# Altium schematic sheet UI.SchDoc
size 420 x 297 mm; SheetNumber: 5; SheetTotal: 6
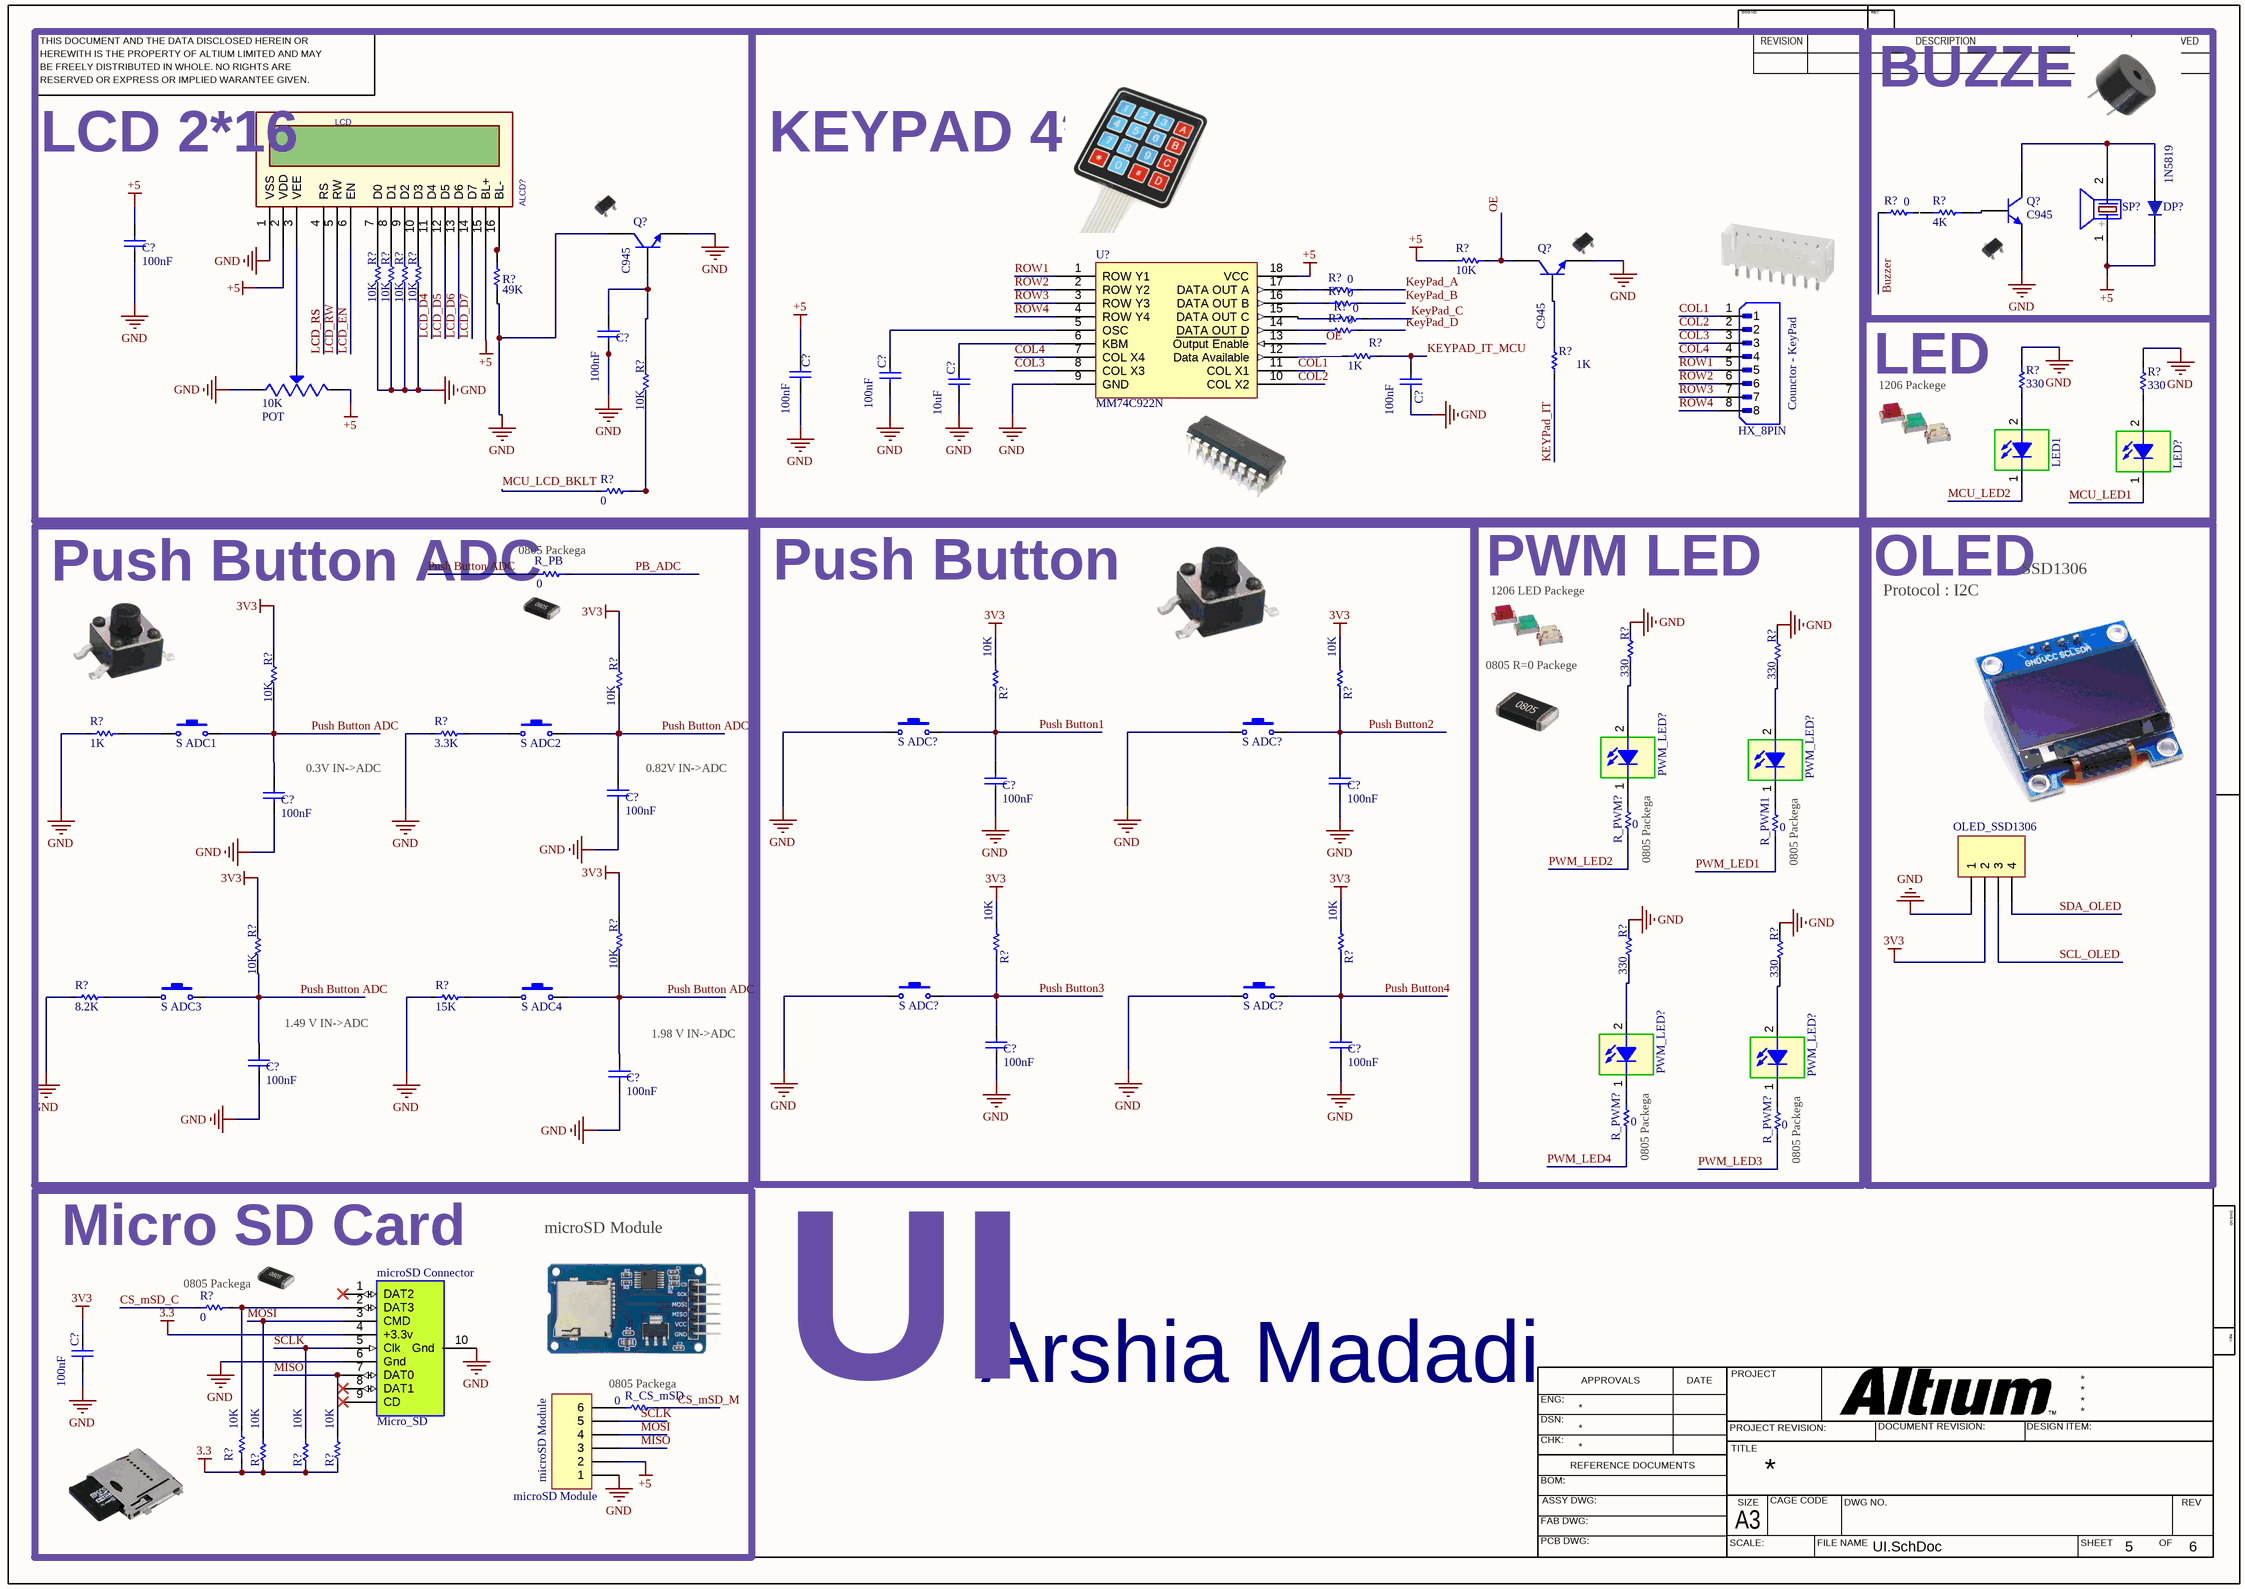
[diagram p0: UI.SchDoc]

## Parts
(Parts that share a designator on the sheet are numbered #1, #2 ... from top to bottom, then left to right.)
10K  POT  [TRIM_3296W1103LF]
ALCD?  LCD  [LCD_2X16 BLUE - 2.5mm]
C?#1  100nF  [MY_CAP_SMD_0603]
C?#2  100nF  [MY_CAP_SMD_0603]
C?#3  100nF  [CAPC3413X12N]
C?#4  100nF  [CAPC4817X12N]
C?#5  10uF  [CAPC4817X12N]
C?#6  100nF  [CAPC4817X12N]
C?#7  100nF  [MY_CAP_SMD_0603]
C?#8  100nF  [MY_CAP_SMD_0603]
C?#9  100nF  [MY_CAP_SMD_0603]
C?#10  100nF  [MY_CAP_SMD_0603]
C?#11  100nF  [MY_CAP_SMD_0603]
C?#12  100nF  [MY_CAP_SMD_0603]
C?#13  100nF  [MY_CAP_SMD_0603]
C?#14  100nF  [MY_CAP_SMD_0603]
C?#15  100nF  [CAPC4817X12N]
Counctor_-_KeyPad  HX_8PIN  [JST_B8B-XH-A(LF)(SN)]
DP?  1N5819  [430X270D]
LED1  SMD 1206 LED  [LED 1206]  (value not drawn)
LED?  SMD 1206 LED  [LED 1206]  (value not drawn)
microSD_Connector  Micro_SD  [MicroSd Connector]
microSD_Module  microSD Module  [HDR1X6-1]
OLED_SSD1306  Header 4  [My_1X04]  (value not drawn)
PWM_LED?#1  SMD 1206 LED  [LED 1206]  (value not drawn)
PWM_LED?#2  SMD 1206 LED  [LED 1206]  (value not drawn)
PWM_LED?#3  SMD 1206 LED  [LED 1206]  (value not drawn)
PWM_LED?#4  SMD 1206 LED  [LED 1206]  (value not drawn)
Q?#1  C945  [SOT23_M]
Q?#2  C945  [SOT23_M]
Q?#3  C945  [SOT23_M]
R?#1  4K  [RESC3413X04N]
R?#2  0  [0805]
R?#3  10K  [RESC3413X04N]
R?#4  10K  [RESC3413X04N]
R?#5  10K  [RESC3413X04N]
R?#6  10K  [RESC3413X04N]
R?#7  49K  [RESC3413X04N]
R?#8  10K  [1206_Res]
R?#9  0  [0805]
R?#10  0  [0805]
R?#11  0  [0805]
R?#12  1K  [1206_Res]
R?#13  0  [0805]
R?#14  330  [0805]
R?#15  330  [0805]
R?#16  1K  [1206_Res]
R?#17  10K  [RESC3413X04N]
R?#18  0  [0805]
R?#19  330  [RESC3413X04N]
R?#20  330  [RESC3413X04N]
R?#21  10K  [RESC3413X04N]
R?#22  10K  [RESC3413X04N]
R?#23  10K  [1206_Res]
R?#24  10K  [1206_Res]
R?#25  1K  [1206_Res]
R?#26  3.3K  [1206_Res]
R?#27  10K  [RESC3413X04N]
R?#28  10K  [RESC3413X04N]
R?#29  330  [RESC3413X04N]
R?#30  330  [RESC3413X04N]
R?#31  10K  [1206_Res]
R?#32  10K  [1206_Res]
R?#33  8.2K  [1206_Res]
R?#34  15K  [1206_Res]
R?#35  0  [0805]
R?#36  10K  [1206_Res]
R?#37  10K  [1206_Res]
R?#38  10K  [1206_Res]
R?#39  10K  [1206_Res]
R_CS_mSD  0  [0805]
R_PB  0  [0805]
R_PWM1  0  [0805]
R_PWM?#1  0  [0805]
R_PWM?#2  0  [0805]
R_PWM?#3  0  [0805]
S_ADC1  Switch PB  [SW-PB]  (value not drawn)
S_ADC2  Switch PB  [SW-PB]  (value not drawn)
S_ADC3  Switch PB  [SW-PB]  (value not drawn)
S_ADC4  Switch PB  [SW-PB]  (value not drawn)
S_ADC?#1  Switch PB  [SW-PB]  (value not drawn)
S_ADC?#2  Switch PB  [SW-PB]  (value not drawn)
S_ADC?#3  Switch PB  [SW-PB]  (value not drawn)
S_ADC?#4  Switch PB  [SW-PB]  (value not drawn)
SP?  (no value)  [BUZZER 7.62mm DC]
U?  MM74C922N  [DIP18]

## Blocks framed on the sheet
LCD 2*16: 10K ALCD? C?#1 C?#2 Q?#2 R?#3-R?#7 R?#17 R?#18
KEYPAD 4*4: C?#3-C?#6 Counctor_-_KeyPad Q?#3 R?#8-R?#13 R?#16 U?
BUZZER: DP? Q?#1 R?#1 R?#2 SP?
LED: LED1 LED? R?#14 R?#15
Push Button ADC: C?#9 C?#10 C?#13 C?#14 R?#21 R?#22 R?#25-R?#28 R?#33 R?#34 R_PB S_ADC1-S_ADC4
Push Button: C?#7 C?#8 C?#11 C?#12 R?#23 R?#24 R?#31 R?#32 S_ADC?#1-S_ADC?#4
PWM LED: PWM_LED?#1-PWM_LED?#4 R?#19 R?#20 R?#29 R?#30 R_PWM1 R_PWM?#1-R_PWM?#3
OLED: OLED_SSD1306
Micro SD Card: C?#15 microSD_Connector microSD_Module R?#35-R?#39 R_CS_mSD

## Nets
3.3: microSD_Connector.4(+3.3v) R?#36.2 R?#37.2 R?#38.2 R?#39.2
3V3: C?#15.2 OLED_SSD1306.2 R?#21.1 R?#22.1 R?#23.2 R?#24.2 R?#27.1 R?#28.1 R?#31.2 R?#32.2
+5: 10K.3(CW) ALCD?.2(VDD) ALCD?.15(BL+) C?#1.1 C?#3.2 DP?.2 microSD_Module.2 R?#8.2 SP?.1(+) U?.18(VCC)
GND: 10K.1(CCW) ALCD?.1(VSS) C?#1.2 C?#2.2 C?#3.1 C?#4.1 C?#5.1 C?#6.1 C?#7.2 C?#8.2 C?#9.2 C?#10.2 C?#11.2 C?#12.2 C?#13.2 C?#14.2 C?#15.1 microSD_Connector.6(Gnd) microSD_Connector.10(Gnd) microSD_Module.1 OLED_SSD1306.1 Q?#1.2(E) Q?#2.2(E) Q?#2.3(C) Q?#3.2(E) R?#3.2 R?#4.2 R?#5.2 R?#6.2 R?#7.2 R?#14.1 R?#15.1 R?#19.1 R?#20.1 R?#25.1 R?#26.1 R?#29.1 R?#30.1 R?#33.1 R?#34.1 S_ADC?#1.1 S_ADC?#2.1 S_ADC?#3.1 S_ADC?#4.1 U?.9(GND)
Buzzer: R?#2.2
COL1: Counctor_-_KeyPad.1 U?.11(COL_X1)
COL2: Counctor_-_KeyPad.2 U?.10(COL_X2)
COL3: Counctor_-_KeyPad.3 U?.8(COL_X3)
COL4: Counctor_-_KeyPad.4 U?.7(COL_X4)
CS_mSD_C: R?#35.2
CS_mSD_M: R_CS_mSD.1
KeyPad_A: R?#9.1
KeyPad_B: R?#10.1
KeyPad_C: R?#11.1
KeyPad_D: R?#13.1
KEYPad_IT: R?#16.1
KEYPAD_IT_MCU: C?#6.2 R?#12.2
LCD_D4: ALCD?.11(D4)
LCD_D5: ALCD?.12(D5)
LCD_D6: ALCD?.13(D6)
LCD_D7: ALCD?.14(D7)
LCD_EN: ALCD?.6(EN)
LCD_RS: ALCD?.4(RS)
LCD_RW: ALCD?.5(RW)
MCU_LCD_BKLT: R?#18.2
MCU_LED1: LED?.1
MCU_LED2: LED1.1
MISO: microSD_Connector.7(DAT0) microSD_Module.3 R?#39.1
MOSI: microSD_Connector.3(CMD) microSD_Module.4 R?#37.1
OE: Q?#3.3(C) R?#8.1 U?.13(Output_Enable)
PB_ADC: R_PB.1
Push Button1: C?#7.1 R?#23.1 S_ADC?#1.2
Push Button2: C?#8.1 R?#24.1 S_ADC?#2.2
Push Button3: C?#11.1 R?#31.1 S_ADC?#3.2
Push Button4: C?#12.1 R?#32.1 S_ADC?#4.2
Push Button ADC: C?#9.1 C?#10.1 C?#13.1 C?#14.1 R?#21.2 R?#22.2 R?#27.2 R?#28.2 R_PB.2 S_ADC1.2 S_ADC2.2 S_ADC3.2 S_ADC4.2
PWM_LED1: R_PWM1.1
PWM_LED2: R_PWM?#1.1
PWM_LED3: R_PWM?#3.1
PWM_LED4: R_PWM?#2.1
ROW1: Counctor_-_KeyPad.5 U?.1(ROW_Y1)
ROW2: Counctor_-_KeyPad.6 U?.2(ROW_Y2)
ROW3: Counctor_-_KeyPad.7 U?.3(ROW_Y3)
ROW4: Counctor_-_KeyPad.8 U?.4(ROW_Y4)
SCL_OLED: OLED_SSD1306.3
SCLK: microSD_Connector.5(Clk) microSD_Module.5 R?#38.1
SDA_OLED: OLED_SSD1306.4
Net10K_2: 10K.2(WIPER) ALCD?.3(VEE)
NetALCD?_7: ALCD?.7(D0) R?#3.1
NetALCD?_8: ALCD?.8(D1) R?#4.1
NetALCD?_9: ALCD?.9(D2) R?#5.1
NetALCD?_10: ALCD?.10(D3) R?#6.1
NetALCD?_16: ALCD?.16(BL-) R?#7.1
NetC?#2_1: C?#2.1 Q?#2.1(B) R?#17.1
NetC?#4_2: C?#4.2 U?.5(OSC)
NetC?#5_2: C?#5.2 U?.6(KBM)
NetDP?_1: DP?.1 Q?#1.3(C) SP?.2(-)
NetLED1_2: LED1.2 R?#14.2
NetLED?_2: LED?.2 R?#15.2
NetmicroSD_Connector_2: microSD_Connector.2(DAT3) R?#35.1 R?#36.1
NetmicroSD_Module_6: microSD_Module.6 R_CS_mSD.2
NetPWM_LED?#1_1: PWM_LED?#1.1 R_PWM?#1.2
NetPWM_LED?#1_2: PWM_LED?#1.2 R?#19.2
NetPWM_LED?#2_1: PWM_LED?#2.1 R_PWM1.2
NetPWM_LED?#2_2: PWM_LED?#2.2 R?#20.2
NetPWM_LED?#3_1: PWM_LED?#3.1 R_PWM?#2.2
NetPWM_LED?#3_2: PWM_LED?#3.2 R?#29.2
NetPWM_LED?#4_1: PWM_LED?#4.1 R_PWM?#3.2
NetPWM_LED?#4_2: PWM_LED?#4.2 R?#30.2
NetQ?#1_1: Q?#1.1(B) R?#1.1
NetQ?#3_1: Q?#3.1(B) R?#16.2
NetR?#9_2: R?#9.2 U?.17(DATA_OUT_A)
NetR?#10_2: R?#10.2 U?.16(DATA_OUT_B)
NetR?#11_2: R?#11.2 U?.15(DATA_OUT_C)
NetR?#12_1: R?#12.1 U?.12(Data_Available)
NetR?#13_2: R?#13.2 U?.14(DATA_OUT_D)
NetR?#17_2: R?#17.2 R?#18.1
NetR?#25_2: R?#25.2 S_ADC1.1
NetR?#26_2: R?#26.2 S_ADC2.1
NetR?#33_2: R?#33.2 S_ADC3.1
NetR?#34_2: R?#34.2 S_ADC4.1

Not connected (* = marked no-connect by the designer): microSD_Connector 1(DAT2)* 8(DAT1)* 9(CD)*; R?#1 2; R?#2 1

## Notes on the sheet
- 1206 Packege
- (near R_PB) 0805 Packega
- 1206 LED Packege
- Protocol : I2C
- SSD1306
- (near R?#19) 0805 R=0 Packege
- (near C?#9) 0.3V IN->ADC
- (near C?#10) 0.82V IN->ADC
- 0805 Packega
- (near C?#13) 1.49 V IN->ADC
- (near C?#14) 1.98 V IN->ADC
- microSD Module
- (near R?#35) 0805 Packega
- Arshia Madadi
- UI
- THIS DOCUMENT AND THE DATA DISCLOSED HEREIN OR
- HEREWITH IS THE PROPERTY OF ALTIUM LIMITED AND MAY
- DWG NO:
- REVISION
- REV:
- DESCRIPTION
- DATE
- APPROVED
- BE FREELY DISTRIBUTED IN WHOLE. NO RIGHTS ARE
- RESERVED OR EXPRESS OR IMPLIED WARANTEE GIVEN.
- ENG:
- APPROVALS
- PROJECT
- DSN:
- CHK:
- REFERENCE DOCUMENTS
- PROJECT REVISION:
- TITLE
- DOCUMENT REVISION:
- DESIGN ITEM:
- BOM:
- FAB DWG:
- PCB DWG:
- ASSY DWG:
- SCALE:
- A3
- SIZE
- CAGE CODE
- FILE NAME
- DWG NO.
- SHEET
- OF
- REV

## Library data of the parts
10K = 3296W1103LF: Trimmer, Potentiometer 10kohm 25turn Thd; MF: Bourns; Package: None; MP: 3296W1103LF; Check_prices: https://www.snapeda.com/parts/3296W1103LF/Bourns/view-part/2487625/?ref=eda; Availability: Unavailable; Price: None; Value: *; SnapEDA_Link: https://www.snapeda.com/parts/3296W1103LF/Bourns/view-part/2487625/?ref=snap
ALCD? = LCD: Alphanumic LCD; Designer: Abbas Basereh; Data: 16-12-2016
C?#1 C?#2 C?#7-C?#14 = CAP SMD_0603: 1.6 mm × 0.8 mm
C?#3 = CAP SMD 0805: CAP 0805; Designer: Abbas Basereh; Desc.: CAP SMD 0805; Data: 16-12-2016
C?#4-C?#6 C?#15 = CAP SMD 1206: CAP 1206; Designer: Abbas Basereh; Desc.: CAP SMD 1206; Data: 16-12-2016
Counctor_-_KeyPad = B8B-XH-A(LF)(SN): Connector Header Through Hole 8 position 0.098 (2.50mm); MF: JST Sales America Inc.; SnapEDA_Link: https://www.snapeda.com/parts/B8B-XH-A(LF)(SN)/JST+Sales+America+Inc./view-part/?ref=snap; Package: None; Value: *; MP: B8B-XH-A(LF)(SN); Check_prices: https://www.snapeda.com/parts/B8B-XH-A(LF)(SN)/JST+Sales+America+Inc./view-part/?ref=eda
DP? = 1N5819: Schottkey Rectifiers; Designer: Abbas Basereh; Data: 16-12-2016; Link: *; Part. No: *
LED1 LED? PWM_LED?#1-PWM_LED?#4 = LED SMD 1206
microSD_Connector = Micro_SD: Micro sd in SD MODE 4pin
microSD_Module = Header 6: Header, 6-Pin; LatestRevisionDate: 17-Jul-2002; LatestRevisionNote: Re-released for DXP Platform.; Publisher: Altium Limited
OLED_SSD1306 = Header 4: Header, 4-Pin; LatestRevisionDate: 17-Jul-2002; LatestRevisionNote: Re-released for DXP Platform.; Publisher: Altium Limited
Q?#1-Q?#3 = C945: NPN Silicon Epitaxial Planar Transistor; Published: 2017-2-8; LatestRevisionDate: 2017; LatestRevisionNote: IPC-7351 Footprint Added.; DatasheetVersion: 2017; PackageVersion: 2017-2-8; PackageReference: SOT23; Publisher: Abbas Basereh; PackageDescription: 3-Pin SOT-23 Package 0.95 mm Pitch, 2.3 mm Lead Span; ComponentLink1Description: Manufacturer Link; ComponentLink1URL: http://www.taitroncomponents.com/; ComponentLink2Description: Datasheet; ComponentLink2URL: http://www.taitroncomponents.com/
R?#1 R?#3-R?#7 R?#17 R?#19-R?#22 R?#27-R?#30 = RES 0805 0.125W: RES 0805; Designer: Abbas Basereh; Desc.: RES SMD 0805; Data: 16-12-2016
R?#2 R?#8-R?#16 R?#18 R?#23-R?#26 R?#31-R?#39 R_CS_mSD R_PB R_PWM1 R_PWM?#1-R_PWM?#3 = Res: Resistor; Published: 8-Jun-2000; LatestRevisionDate: 17-Jul-2002; LatestRevisionNote: Re-released for DXP Platform.; PackageReference: AXIAL-0.3; Publisher: Altium Limited
S_ADC1-S_ADC4 S_ADC?#1-S_ADC?#4 = Switch PB: Push Button Switch
SP? = PIEZO BUZZER: PIEZO BUZZER ACTIVE; Designer: Abbas Basereh; Comment_1: SPEAKER AND BEEP; Design Date: 1395/11/14; ComponentLink2Description: Reference; PackageDescription: THD; Publisher: Abbas Basereh; Mounting Technology: THD; Pin Count: 2; Status: Unreleased
U? = MM74c922N_Fairchild: 16-Key Encoder